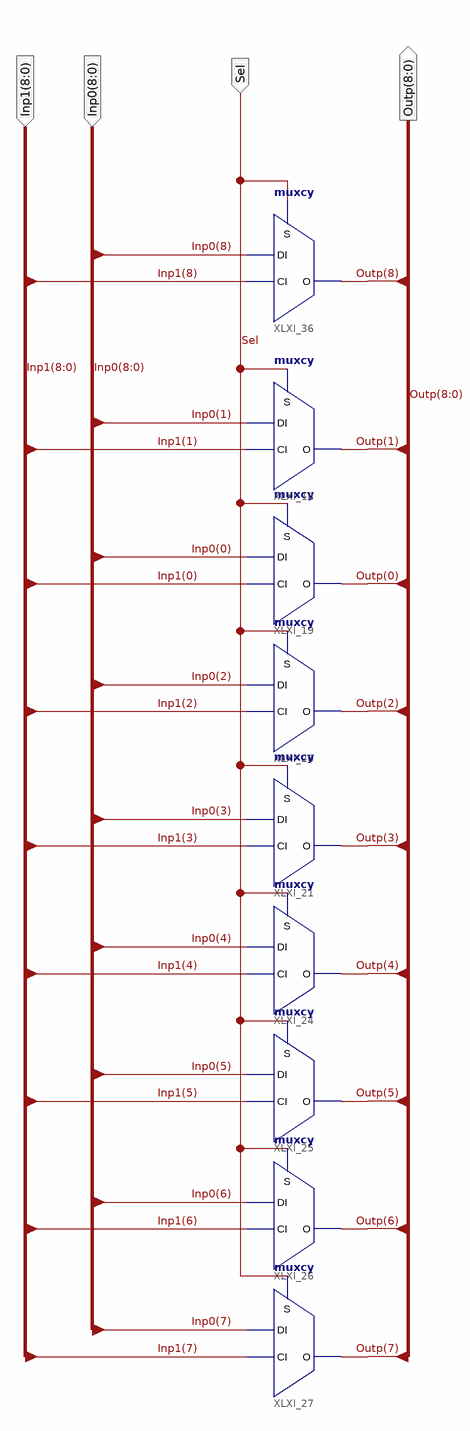
[diagram p0: schematic sheet 1]
// Xilinx ISE schematic Mux_2_9.sch (spartan3e) as structural Verilog: 9 symbols, 4 ports
module Mux_2_9 (
  input  [8:0] Inp1,
  input  [8:0] Inp0,
  input  Sel,
  output [8:0] Outp
);

  muxcy XLXI_19 (.CI(Inp1[0]), .DI(Inp0[0]), .S(Sel), .O(Outp[0]));
  muxcy XLXI_18 (.CI(Inp1[1]), .DI(Inp0[1]), .S(Sel), .O(Outp[1]));
  muxcy XLXI_20 (.CI(Inp1[2]), .DI(Inp0[2]), .S(Sel), .O(Outp[2]));
  muxcy XLXI_21 (.CI(Inp1[3]), .DI(Inp0[3]), .S(Sel), .O(Outp[3]));
  muxcy XLXI_24 (.CI(Inp1[4]), .DI(Inp0[4]), .S(Sel), .O(Outp[4]));
  muxcy XLXI_25 (.CI(Inp1[5]), .DI(Inp0[5]), .S(Sel), .O(Outp[5]));
  muxcy XLXI_26 (.CI(Inp1[6]), .DI(Inp0[6]), .S(Sel), .O(Outp[6]));
  muxcy XLXI_27 (.CI(Inp1[7]), .DI(Inp0[7]), .S(Sel), .O(Outp[7]));
  muxcy XLXI_36 (.CI(Inp1[8]), .DI(Inp0[8]), .S(Sel), .O(Outp[8]));
endmodule
